# EAGLE design stm32f4_fc_simplified (EAGLE 8.2.2)
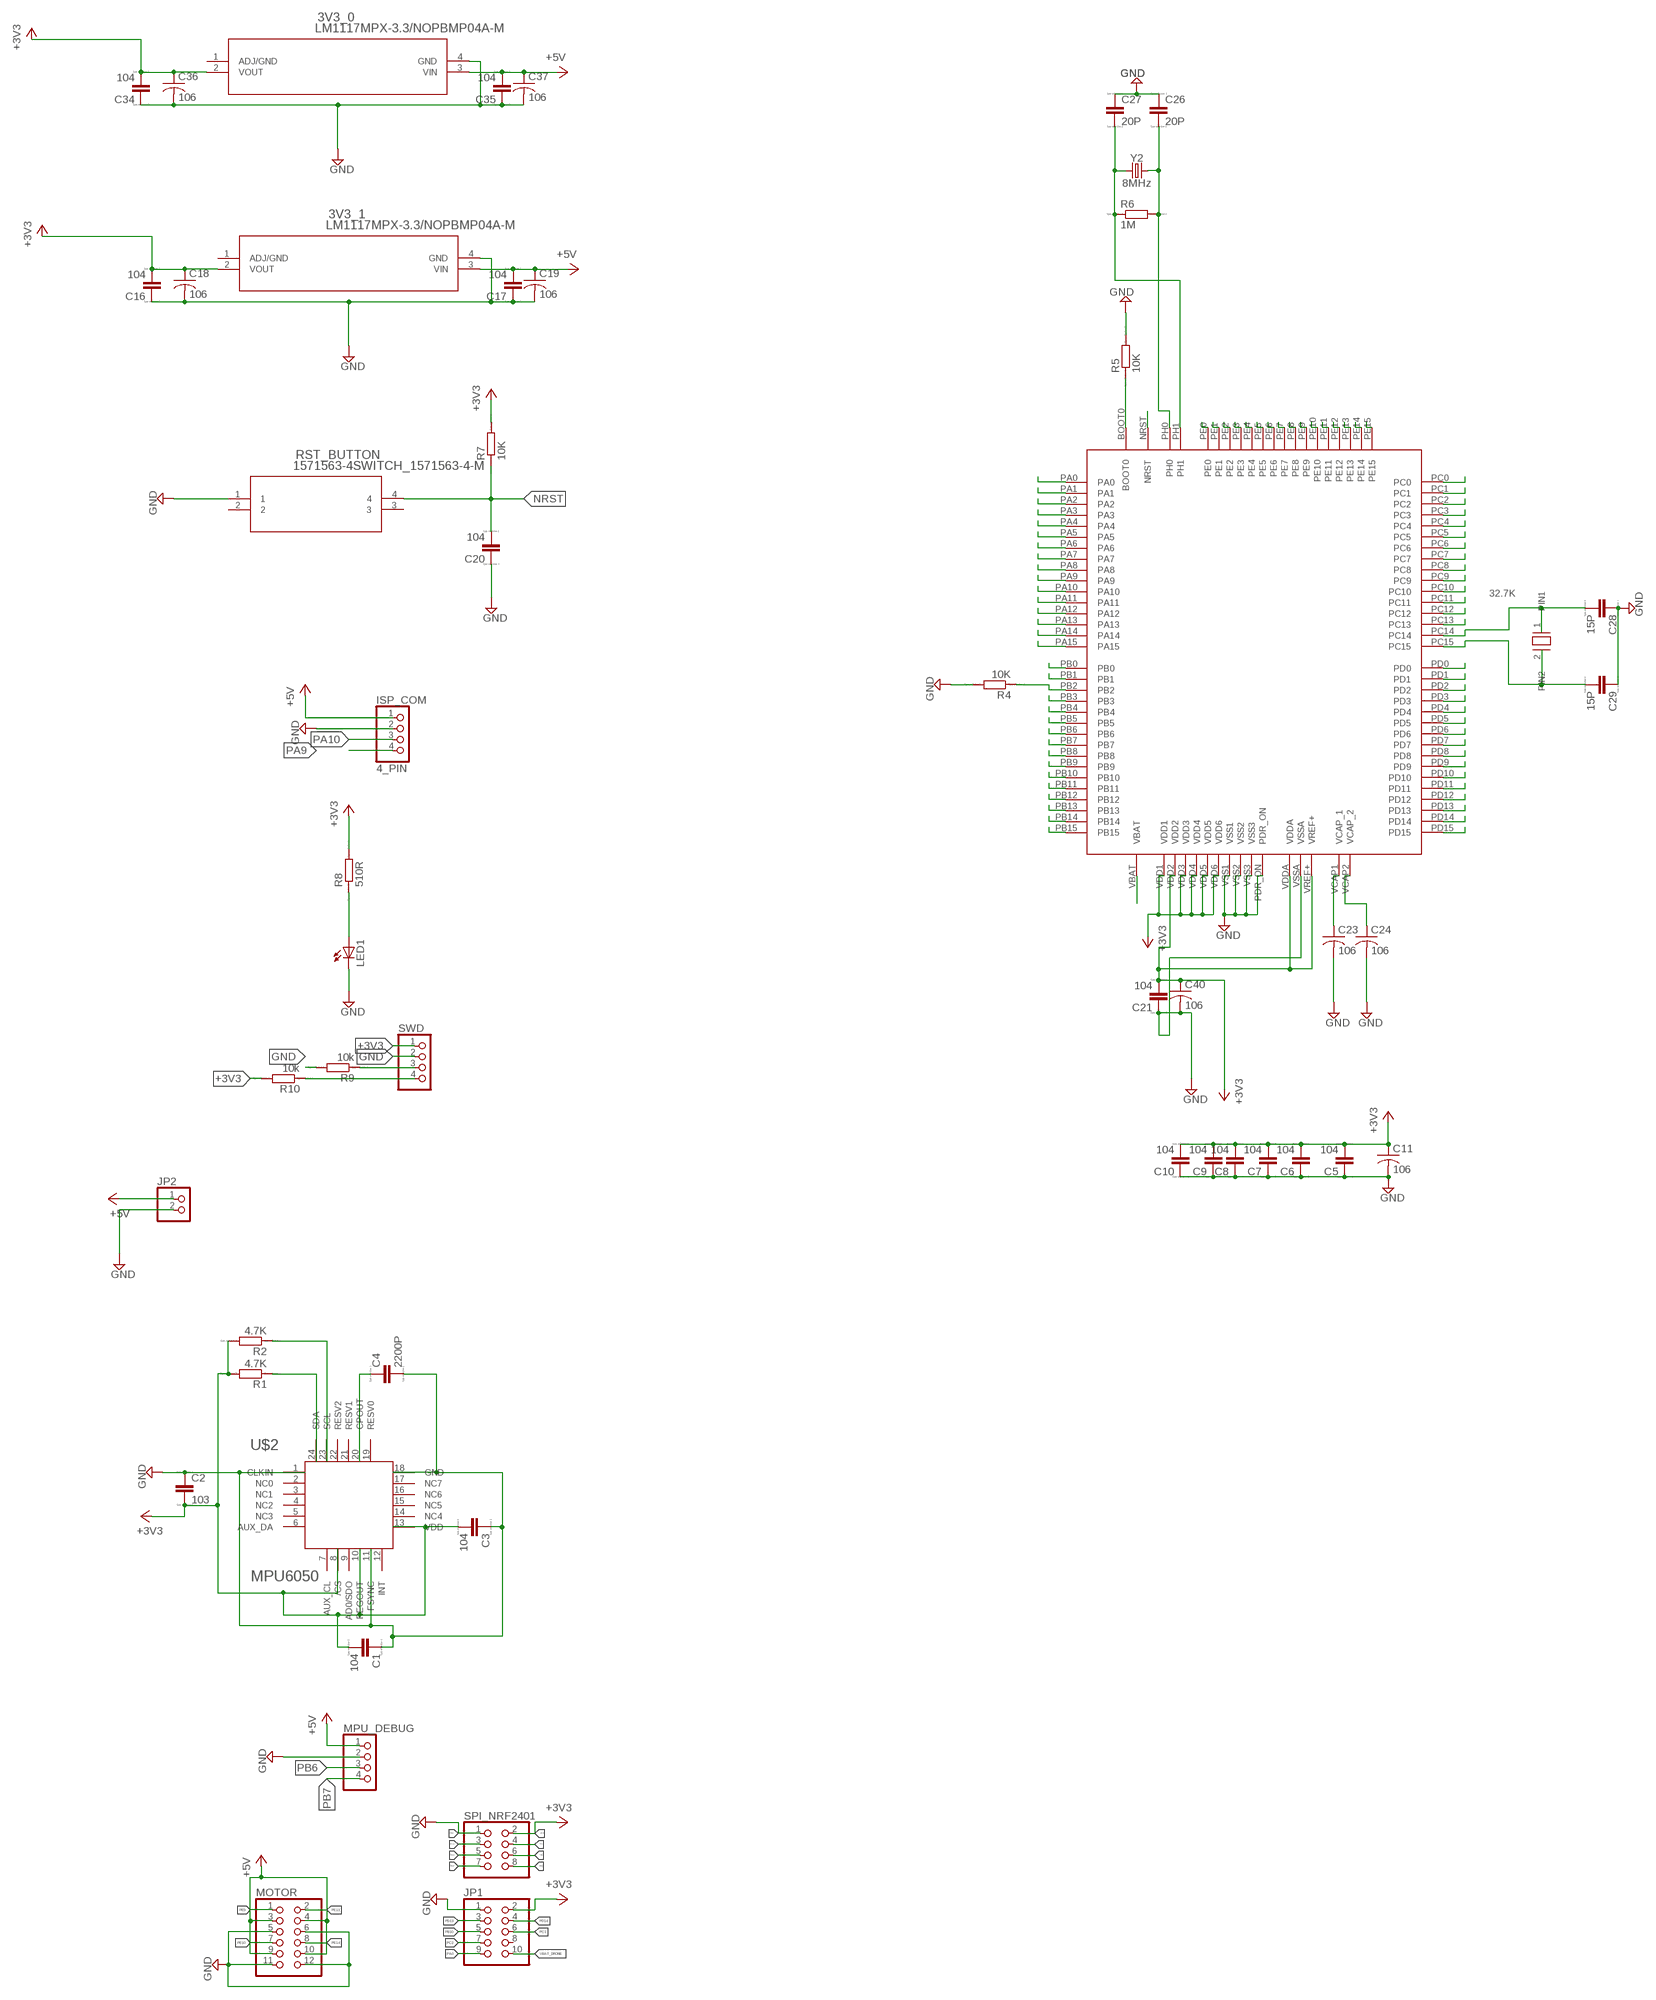
[diagram p0: schematic, sheet 1]

## Parts
3V3_0  LM1117MPX-3.3/NOPBMP04A-M  [MP04A-M]
3V3_1  LM1117MPX-3.3/NOPBMP04A-M  [MP04A-M]
32.7K  CM315D  [CM315D_32.7K]
C1  104  CC0603  [C0603]
C2  103  CC0603  [C0603]
C3  104  CC0603  [C0603]
C4  2200P  CC0603  [C0603]
C5  104  CC0603  [C0603]
C6  104  CC0603  [C0603]
C7  104  CC0603  [C0603]
C8  104  CC0603  [C0603]
C9  104  CC0603  [C0603]
C10  104  CC0603  [C0603]
C11  106  C-USC0805  [C0805]
C16  104  CC0603  [C0603]
C17  104  CC0603  [C0603]
C18  106  C-USC0805  [C0805]
C19  106  C-USC0805  [C0805]
C20  104  CC0603  [C0603]
C21  104  CC0603  [C0603]
C23  106  C-USC0805  [C0805]
C24  106  C-USC0805  [C0805]
C26  20P  CC0603  [C0603]
C27  20P  CC0603  [C0603]
C28  15P  CC0603  [C0603]
C29  15P  CC0603  [C0603]
C34  104  CC0603  [C0603]
C35  104  CC0603  [C0603]
C36  106  C-USC0805  [C0805]
C37  106  C-USC0805  [C0805]
C40  106  C-USC0805  [C0805]
ISP_COM  4_PIN  PINHD-1X4  [1X04]
JP1  PINHD-2X5/90  [2X05/90]
JP2  PINHD-1X2  [1X02]
LED1  LEDCHIPLED_0805  [CHIPLED_0805]
MOTOR  PINHD-2X6/90  [2X06/90]
MPU_DEBUG  PINHD-1X4  [1X04]
R1  4.7K  RR0603  [R0603]
R2  4.7K  RR0603  [R0603]
R4  10K  RR0603  [R0603]
R5  10K  RR0603  [R0603]
R6  1M  RR0603  [R0603]
R7  10K  RR0603  [R0603]
R8  510R  RR0603  [R0603]
R9  10k  RR0603  [R0603]
R10  10k  RR0603  [R0603]
RST_BUTTON  1571563-4SWITCH_1571563-4-M  [SWITCH_1571563-4-M]
SPI_NRF2401  PINHD-2X4  [2X04]
SWD  PINHD-1X4  [1X04]
U$1  STM32F4V_100PIN_GENERIC  [LQFP100]
U$2  MPU6050  [MPU6050]
Y2  8MHz  CRYSTAL-8MHZSMD-HC49UP  [HC49UP]

## Nets
+3V3: 3V3_0.2(VOUT) 3V3_1.2(VOUT) C1.2 C2.2 C3.2 C5.2 C6.2 C7.2 C8.2 C9.2 C10.2 C11.1 C16.2 C18.1 C21.2 C34.2 C36.1 C40.1 JP1.2 R1.2 R2.2 R7.2 R8.2 R10.2 SPI_NRF2401.2 SWD.1 U$1.VDD1 U$1.VDD2 U$1.VDD3 U$1.VDD4 U$1.VDD5 U$1.VDD6 U$1.VDDA U$1.VREF+ U$2.8(/CS) U$2.10(REGOUT) U$2.13(VDD)
+5V: 3V3_0.3(VIN) 3V3_1.3(VIN) C17.2 C19.1 C35.2 C37.1 ISP_COM.1 JP2.1 MOTOR.3 MOTOR.4 MOTOR.9 MOTOR.10 MPU_DEBUG.1
BOOT0: R5.1 U$1.BOOT0
GND: 3V3_0.4(GND) 3V3_1.4(GND) C1.1 C2.1 C3.1 C4.2 C5.1 C6.1 C7.1 C8.1 C9.1 C10.1 C11.2 C16.1 C17.1 C18.2 C19.2 C20.1 C21.1 C23.2 C24.2 C26.1 C27.1 C28.1 C29.1 C34.1 C35.1 C36.2 C37.2 C40.2 ISP_COM.2 JP1.1 JP2.2 LED1.C MOTOR.5 MOTOR.6 MOTOR.11 MOTOR.12 MPU_DEBUG.2 R4.2 R5.2 R9.2 RST_BUTTON.1 SPI_NRF2401.1 SWD.2 U$1.PDR_ON U$1.VSS1 U$1.VSS2 U$1.VSS3 U$1.VSSA U$2.1(CLKIN) U$2.11(FSYNC) U$2.18(GND)
IRQ: SPI_NRF2401.8
N$1: LED1.A R8.1
N$3: C4.1 U$2.20(CPOUT)
NRST: C20.2 R7.1 RST_BUTTON.4 U$1.NRST
PA0: JP1.9 U$1.PA0
PA1: U$1.PA1
PA2: U$1.PA2
PA3: U$1.PA3
PA4: U$1.PA4
PA5: SPI_NRF2401.5 U$1.PA5
PA6: SPI_NRF2401.7 U$1.PA6
PA7: SPI_NRF2401.6 U$1.PA7
PA8: U$1.PA8
PA9: ISP_COM.4 U$1.PA9
PA10: ISP_COM.3 U$1.PA10
PA11: U$1.PA11
PA12: U$1.PA12
PA13: R10.1 SWD.4 U$1.PA13
PA14: R9.1 SWD.3 U$1.PA14
PA15: U$1.PA15
PB0: U$1.PB0
PB1: U$1.PB1
PB2: R4.1 U$1.PB2
PB3: U$1.PB3
PB4: U$1.PB4
PB5: U$1.PB5
PB6: MPU_DEBUG.3 R2.1 U$1.PB6 U$2.23(SCL)
PB7: MPU_DEBUG.4 R1.1 U$1.PB7 U$2.24(SDA)
PB8: U$1.PB8
PB9: U$1.PB9
PB10: JP1.5 U$1.PB10
PB11: U$1.PB11
PB12: U$1.PB12
PB13: U$1.PB13
PB14: U$1.PB14
PB15: U$1.PB15
PC0: U$1.PC0
PC1: U$1.PC1
PC2: JP1.7 U$1.PC2
PC3: JP1.6 U$1.PC3
PC4: SPI_NRF2401.3 U$1.PC4
PC5: SPI_NRF2401.4 U$1.PC5
PC6: U$1.PC6
PC7: U$1.PC7
PC8: U$1.PC8
PC9: U$1.PC9
PC10: U$1.PC10
PC11: U$1.PC11
PC12: U$1.PC12
PC13: U$1.PC13
PC14: 32.7K.1(PIN1) C28.2 U$1.PC14
PC15: 32.7K.2(PIN2) C29.2 U$1.PC15
PD0: U$1.PD0
PD1: U$1.PD1
PD2: U$1.PD2
PD3: U$1.PD3
PD4: U$1.PD4
PD5: U$1.PD5
PD6: U$1.PD6
PD7: U$1.PD7
PD8: U$1.PD8
PD9: U$1.PD9
PD10: U$1.PD10
PD11: U$1.PD11
PD12: U$1.PD12
PD13: JP1.3 U$1.PD13
PD14: JP1.4 U$1.PD14
PD15: U$1.PD15
PE0: U$1.PE0
PE1: U$1.PE1
PE2: U$1.PE2
PE3: U$1.PE3
PE4: U$1.PE4
PE5: U$1.PE5
PE6: U$1.PE6
PE7: U$1.PE7
PE8: U$1.PE8
PE9: MOTOR.1 U$1.PE9
PE10: MOTOR.7 U$1.PE10
PE11: U$1.PE11
PE12: U$1.PE12
PE13: MOTOR.2 U$1.PE13
PE14: MOTOR.8 U$1.PE14
PE15: U$1.PE15
PH0: C26.2 R6.2 U$1.PH0 Y2.2
PH1: C27.2 R6.1 U$1.PH1 Y2.1
VBAT: U$1.VBAT
VBAT_DRONE: JP1.10
VCAP1: C23.1 U$1.VCAP1(VCAP_1)
VCAP2: C24.1 U$1.VCAP2(VCAP_2)
Unconnected: 3V3_0.1(ADJ/GND) 3V3_1.1(ADJ/GND) JP1.8 RST_BUTTON.2 RST_BUTTON.3 U$2.2(NC0) U$2.3(NC1) U$2.4(NC2) U$2.5(NC3) U$2.6(AUX_DA) U$2.7(AUX_CL) U$2.9(AD0/SDO) U$2.12(INT) U$2.14(NC4) U$2.15(NC5) U$2.16(NC6) U$2.17(NC7) U$2.19(RESV0) U$2.21(RESV1) U$2.22(RESV2)

## Library data of the parts
3V3_0 3V3_1 = lm1117:LM1117MPX-3.3/NOPB; MANUFACTURER_PART_NUMBER: LM1117MPX3.3NOPB; VENDOR: National Semiconductor
32.7K = CM315D_PAC:CM315D
C1-C10 C16 C17 C20 C21 C26-C29 C34 C35 = eagle-ltspice:C: CAPACITOR, European symbol; SPICEMODEL: NONE; SPICEPREFIX: C
C11 C18 C19 C23 C24 C36 C37 C40 = rcl:C-US: CAPACITOR, American symbol
ISP_COM MPU_DEBUG SWD = pinhead:PINHD-1X4: PIN HEADER
JP1 = pinhead:PINHD-2X5: PIN HEADER
JP2 = pinhead:PINHD-1X2: PIN HEADER
LED1 = led:LED: LED OSRAM: - CHIPLED LG R971, LG N971, LY N971, LG Q971, LY Q971, LO R971, LY R971 LH N974, LH R974 LS Q976, LO Q976, LY Q976 LO Q996 - Hyper CHIPLED LW Q18S LB Q993, LB Q99A, LB R99A - SideLED LS A670, LO A670, LY A670, LG A670, LP A670 LB A673, LV A673, LT A673, LW A673 LH A674 LY A675 LS A676, LA A676, LO A676, LY A676, LW A676 LS A679, LY A679, LG A679 - Hyper Micro SIDELED® LS Y876, LA Y876, LO Y876, LY Y876 LT Y87S - SmartLED LW L88C, LW L88S LB L89C, LB L89S, LG L890 LS L89K, LO L89K, LY L89K LS L896, LA L896, LO L896, LY L896 - TOPLED LS T670, LO T670, LY T670, LG T670, LP T670 LSG T670, LSP T670, LSY T670, LOP T670, LYG T670 LG T671, LOG T671, LSG T671 LB T673, LV T673, LT T673, LW T673 LH T674 LS T676, LA T676, LO T676, LY T676, LB T676, LH T676, LSB T676, LW T676 LB T67C, LV T67C, LT T67C, LS T67K, LO T67K, LY T67K, LW E67C LS E67B, LA E67B, LO E67B, LY E67B, LB E67C, LV E67C, LT E67C LW T67C LS T679, LY T679, LG T679 LS T770, LO T770, LY T770, LG T770, LP T770 LB T773, LV T773, LT T773, LW T773 LH T774 LS E675, LA E675, LY E675, LS T675 LS T776, LA T776, LO T776, LY T776, LB T776 LHGB T686 LT T68C, LB T68C - Hyper Mini TOPLED® LB M676 - Mini TOPLED Santana® LG M470 LS M47K, LO M47K, LY M47K Source: http://www.osram.convergy.de LUXEON: - LUMILED® LXK2-PW12-R00, LXK2-PW12-S00, LXK2-PW14-U00, LXK2-PW14-V00 LXK2-PM12-R00, LXK2-PM12-S00, LXK2-PM14-U00 LXK2-PE12-Q00, LXK2-PE12-R00, LXK2-PE12-S00, LXK2-PE14-T00, LXK2-PE14-U00 LXK2-PB12-K00, LXK2-PB12-L00, LXK2-PB12-M00, LXK2-PB14-N00, LXK2-PB14-P00, LXK2-PB14-Q00 LXK2-PR12-L00, LXK2-PR12-M00, LXK2-PR14-Q00, LXK2-PR14-R00 LXK2-PD12-Q00, LXK2-PD12-R00, LXK2-PD12-S00 LXK2-PH12-R00, LXK2-PH12-S00 LXK2-PL12-P00, LXK2-PL12-Q00, LXK2-PL12-R00 Source: www.luxeon.com KINGBRIGHT: KA-3528ASYC Source: www.kingbright.com
MOTOR = pinhead:PINHD-2X6: PIN HEADER
R1 R2 R4-R10 = eagle-ltspice:R: RESISTOR, European symbol; SPICEMODEL: NONE; SPICEPREFIX: R
RST_BUTTON = pushbutton_sw_surface_mt:1571563-4; MANUFACTURER_PART_NUMBER: 15715634; VENDOR: Tyco Electronics
SPI_NRF2401 = pinhead:PINHD-2X4: PIN HEADER
U$1 = stm32f4:STM32F4V_100PIN_GENERIC
U$2 = mpu6050_pac:MPU6050
Y2 = SparkFun-Clocks:CRYSTAL-8MHZ: 8MHz Crystal Datasheet Example <http://www.futureelectronics.com/en/technologies/electromechanical/timing-devices/crystals/Pages/6008189-ABM3B-8.000MHZ-B2-T.aspx?IM=0> Frequency: 8MHz Frequency Tolerance: ±20ppm Load Capacitance: 18pF SparkFun Products: Pro Micro -3.3V/8MHz <https://www.sparkfun.com/products/12587> WAV Trigger <https://www.sparkfun.com/products/13660>; PROD_ID: XTAL-11706

## Board
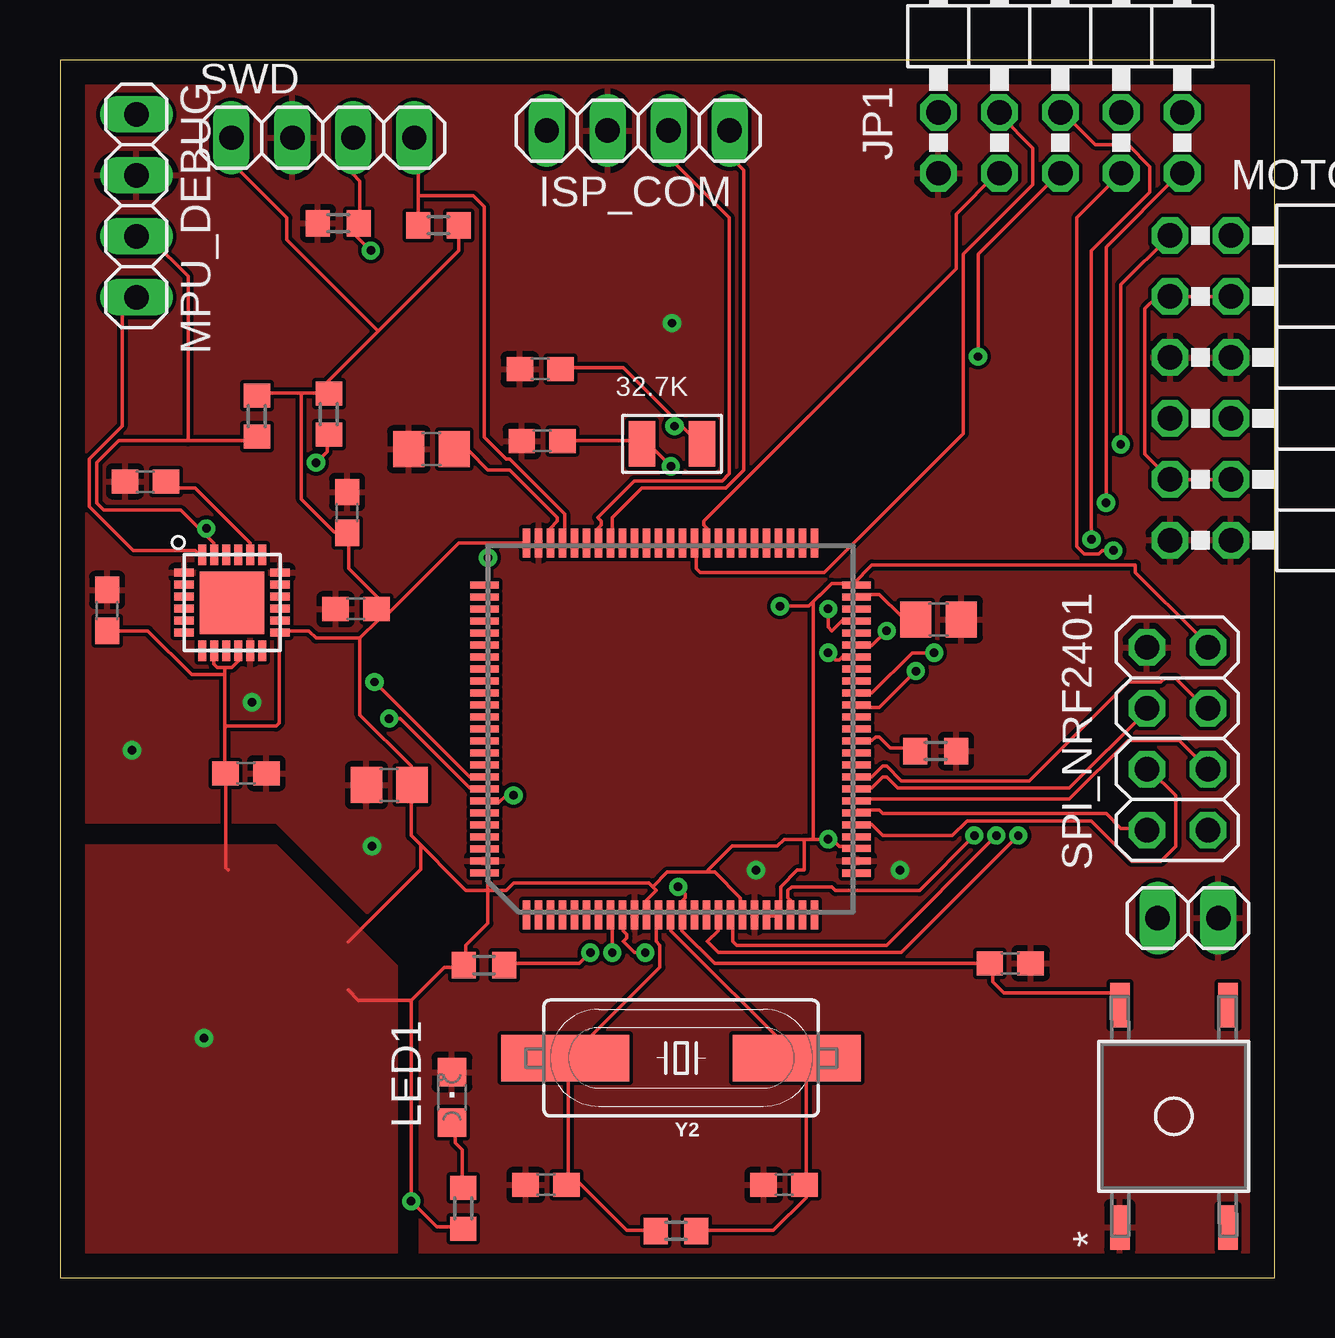
[diagram p1: board, top side]
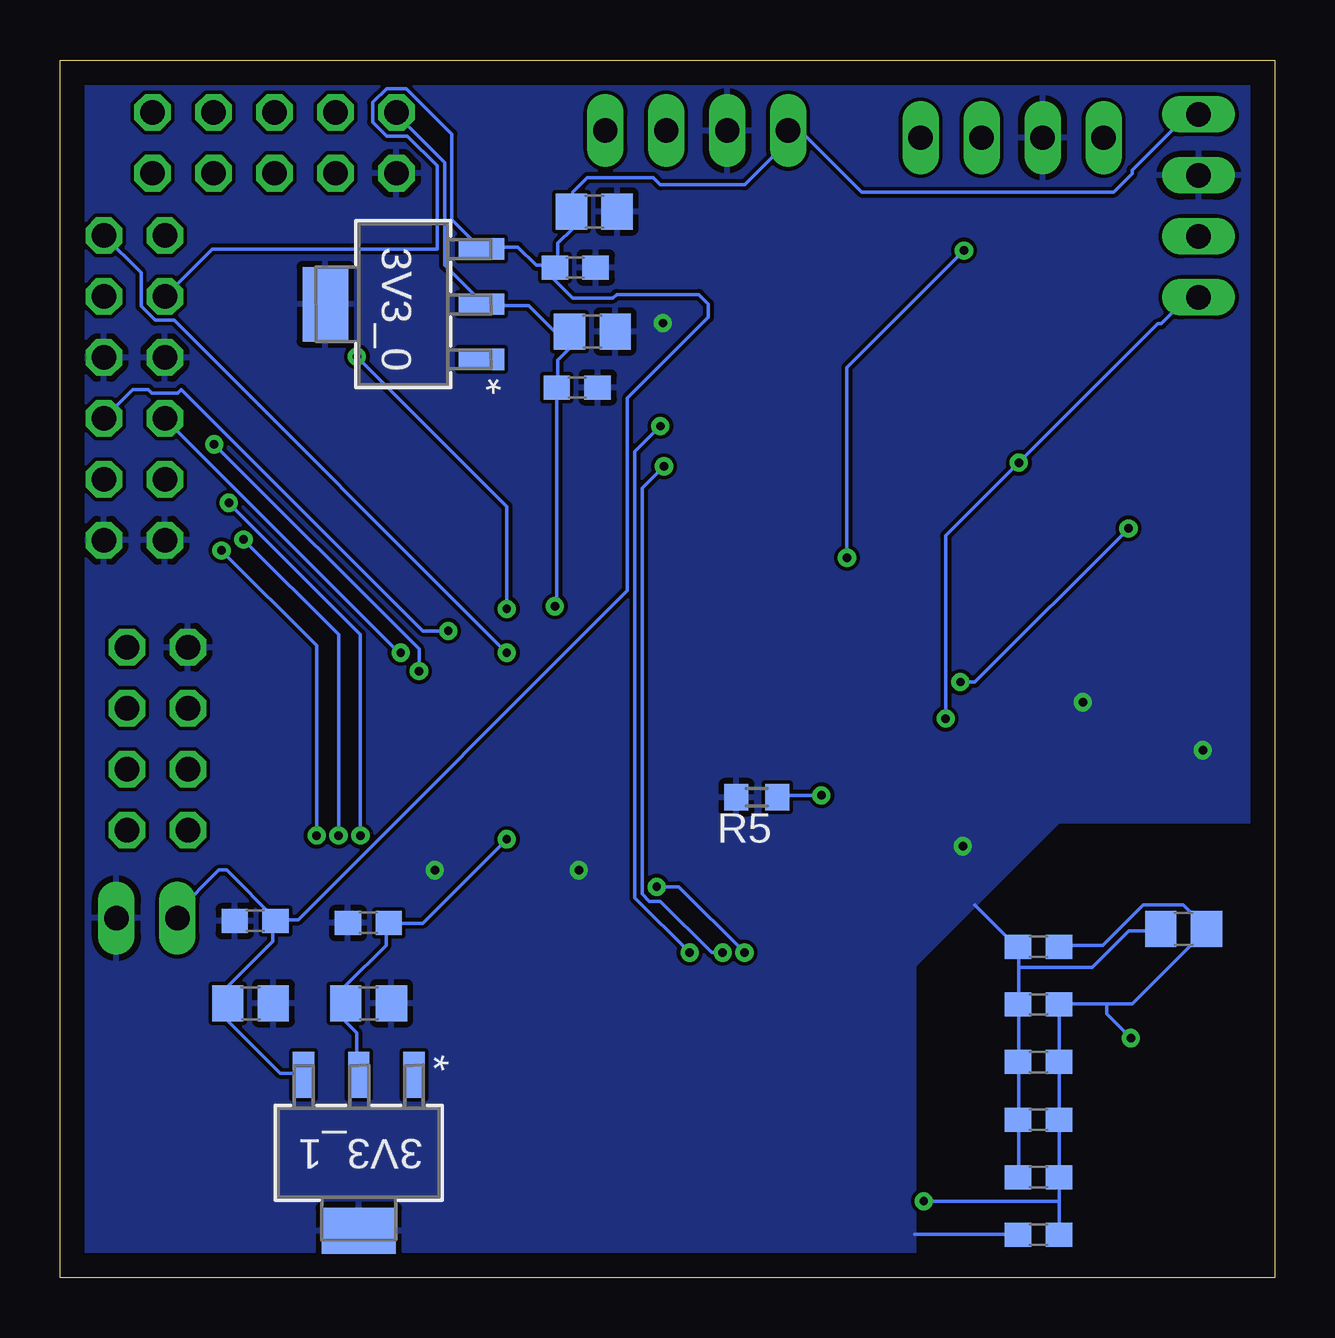
[diagram p2: board, bottom side, seen from below]

Size 50.62 x 50.77 mm. Coordinates in mm from the lower left corner, seen from the top.
Outline: 0,0 50.62,0 50.62,50.77 0,50.77 0,0
Copper layers (1*16): Top 0.035mm / dielectric 1.5mm / Bottom 0.035mm
Design rules "default": minimum track width 6mil, minimum drill 0.35mm, track to track 6mil, track to pad 6mil, pad to pad 6mil, via to via 6mil, smd to smd 6mil, copper to edge 40mil, drill to drill 6mil, minimum pad ring 10mil, minimum via ring 8mil, stop-mask expansion 4mil, vias tented up to drill 0mil, thermal gap 10mil

### Footprints (pad centres in the part's own frame; a part is rotated, then mirrored left to right if it is on the bottom)
MP04A-M = smd 1.905 x 0.889: 1 -3.251,2.3; 2 -3.251,0; 3 -3.251,-2.3 | smd 1.905 x 3.099: 4 3.251,0
CM315D_32.7K = smd 1.1 x 1.9: 1 0,0; 2 2.5,0
C0603 = smd 1.1 x 1: 1 -0.85,0; 2 0.85,0
C0805 = smd 1.3 x 1.5: 1 -0.95,0; 2 0.95,0
1X04 = drill 1.016 long: 1 -3.81,0; 2 -1.27,0; 3 1.27,0; 4 3.81,0
2X05/90 = drill 1.016 octagon: 1 -5.08,-6.35; 2 -5.08,-3.81; 3 -2.54,-6.35; 4 -2.54,-3.81; 5 0,-6.35; 6 0,-3.81; 7 2.54,-6.35; 8 2.54,-3.81; 9 5.08,-6.35; 10 5.08,-3.81
1X02 = drill 1.016 long: 1 -1.27,0; 2 1.27,0
CHIPLED_0805 = smd 1.2 x 1.2: A 0,-1.05; C 0,1.05
2X06/90 = drill 1.016 octagon: 1 -6.35,-6.35; 2 -6.35,-3.81; 3 -3.81,-6.35; 4 -3.81,-3.81; 5 -1.27,-6.35; 6 -1.27,-3.81; 7 1.27,-6.35; 8 1.27,-3.81; 9 3.81,-6.35; 10 3.81,-3.81; 11 6.35,-6.35; 12 6.35,-3.81
R0603 = smd 1 x 1.1: 1 -0.85,0; 2 0.85,0
SWITCH_1571563-4-M = smd 1.854 x 0.813: 1 -4.636,2.248; 2 -4.636,-2.248; 3 4.636,-2.248; 4 4.636,2.248
2X04 = drill 1.016 octagon: 1 -3.81,-1.27; 2 -3.81,1.27; 3 -1.27,-1.27; 4 -1.27,1.27; 5 1.27,-1.27; 6 1.27,1.27; 7 3.81,-1.27; 8 3.81,1.27
LQFP100 = smd 1.2 x 0.3: BOOT0 -7.75,-3; PA3 7.75,-6.016; PA4 7.75,-4.5; PA5 7.75,-4; PA6 7.75,-3.5; PA7 7.75,-3; PA14 -7.75,6; PA15 -7.75,5.5; PB0 7.75,-1.5; PB1 7.75,-1; PB2 7.75,-0.5; PB3 -7.75,-0.5; PB4 -7.75,-1; PB5 -7.75,-1.5; PB6 -7.75,-2; PB7 -7.75,-2.5; PB8 -7.75,-3.5; PB9 -7.75,-4; PB10 7.75,4.5; PB11 7.75,5; PC4 7.75,-2.5; PC5 7.75,-2; PC10 -7.75,5; PC11 -7.75,4.5; PC12 -7.75,4; PD0 -7.75,3.5; PD1 -7.75,3; PD2 -7.75,2.5; PD3 -7.75,2; PD4 -7.75,1.5; PD5 -7.75,1; PD6 -7.75,0.5; PD7 -7.75,0; PDR_ON -7.75,-5.5; PE0 -7.75,-4.5; PE1 -7.75,-5; PE7 7.75,0; PE8 7.75,0.5; PE9 7.75,1; PE10 7.75,1.5; PE11 7.75,2; PE12 7.75,2.5; PE13 7.75,3; PE14 7.75,3.5; PE15 7.75,4; VCAP1 7.75,5.5; VDD3 7.75,-4.984; VDD4 7.75,6; VDD6 -7.75,-6; VSS2 7.75,-5.5 | smd 0.3 x 1.2: NRST 0.5,-7.75; PA0 5,-7.75; PA1 5.5,-7.75; PA2 6,-7.75; PA8 -2,7.75; PA9 -2.5,7.75; PA10 -3,7.75; PA11 -3.5,7.75; PA12 -4,7.75; PA13 -4.5,7.75; PB12 6,7.75; PB13 5.5,7.75; PB14 5,7.75; PB15 4.5,7.75; PC0 1,-7.75; PC1 1.5,-7.75; PC2 2,-7.75; PC3 2.5,-7.75; PC6 0,7.75; PC7 -0.5,7.75; PC8 -1,7.75; PC9 -1.5,7.75; PC13 -3,-7.75; PC14 -2.5,-7.75; PC15 -2,-7.75; PD8 4,7.75; PD9 3.5,7.75; PD10 3,7.75; PD11 2.5,7.75; PD12 2,7.75; PD13 1.5,7.75; PD14 1,7.75; PD15 0.5,7.75; PE2 -6,-7.75; PE3 -5.5,-7.75; PE4 -5,-7.75; PE5 -4.5,-7.75; PE6 -4,-7.75; PH0 -0.5,-7.75; PH1 0,-7.75; VBAT -3.5,-7.75; VCAP2 -5,7.75; VDD1 -1,-7.75; VDD2 3,-7.75; VDD5 -6,7.75; VDDA 4.5,-7.75; VREF+ 4,-7.75; VSS1 -1.5,-7.75; VSS3 -5.5,7.75; VSSA 3.5,-7.75
MPU6050 = smd 0.8 x 0.34: 1 0,0; 2 0,-0.5; 3 0,-1; 4 0,-1.5; 5 0,-2; 6 0,-2.5; 13 4,-2.5; 14 4,-2; 15 4,-1.5; 16 4,-1; 17 4,-0.5; 18 4,0 | smd 0.34 x 0.85: 7 0.75,-3.25; 8 1.25,-3.25; 9 1.75,-3.25; 10 2.25,-3.25; 11 2.75,-3.25; 12 3.25,-3.25; 19 3.25,0.75; 20 2.75,0.75; 21 2.25,0.75; 22 1.75,0.75; 23 1.25,0.75; 24 0.75,0.75 | smd 2.7 x 2.6: P$26 2,-1.25
HC49UP = smd 5.334 x 1.93: 1 -4.826,0; 2 4.826,0

### Placement (x,y rotation side)
3V3_0  36.31,40.59 180 bottom
3V3_1  38.17,5.22 270 bottom
32.7K  24.25,34.77 0 top
C1  7.75,21.04 180 top
C2  1.96,27.83 270 top
C3  11.96,31.91 270 top
C4  3.56,33.2 180 top
C5  9.85,1.8 0 bottom
C6  9.85,4.2 0 bottom
C7  9.85,6.6 0 bottom
C8  9.85,9 0 bottom
C9  9.85,11.4 0 bottom
C10  9.85,13.8 0 bottom
C11  3.8,14.55 180 bottom
C16  37.77,14.8 0 bottom
C17  42.49,14.88 0 bottom
C18  37.76,11.45 0 bottom
C19  42.68,11.45 0 bottom
C20  39.59,13.12 180 top
C21  12.33,27.88 0 top
C23  36.6,27.45 0 top
C24  15.48,34.55 180 top
C26  20.25,3.88 0 top
C27  30.17,3.88 0 top
C28  20.09,34.88 0 top
C29  20.01,37.88 0 top
C34  29.07,37.12 180 bottom
C35  29.15,42.12 180 bottom
C36  28.44,39.45 0 bottom
C37  28.36,44.45 0 bottom
C40  13.72,20.55 180 top
ISP_COM  24.09,47.83 0 top
JP1  41.68,52.4 0 top
JP2  47,15 0 top
LED1  16.33,7.53 0 top
MOTOR  52.6,37.1 270 top
MPU_DEBUG  3.18,44.69 270 top
R1  11.2,36.01 90 top
R2  8.2,35.93 90 top
R4  36.49,21.96 0 top
R5  21.59,20.04 180 bottom
R6  25.67,1.96 180 top
R7  17.67,13.04 180 top
R8  16.8,2.91 270 top
R9  11.59,43.96 180 top
R10  15.77,43.88 0 top
RST_BUTTON  46.41,6.74 90 top
SPI_NRF2401  46.56,22.48 270 top
SWD  10.95,47.53 0 top
U$1  25.44,22.89 0 top
U$2  5.17,29.4 0 top
Y2  25.88,9.17 180 top

### Tracks (layer width: path | path; a pad name or v marks a point on that pad's centre or on a via)
+3V3  (via drill 0.35)
  Top 0.152: SPI_NRF2401.2 47.7,26.36 47.4,26.67 47.4,26.82 44.81,29.41 44.81,29.72 33.83,29.72 33.07,28.96 | 11.12,36.88 10.06,36.88 | 10.06,36.88 8.23,36.88 R2.2 | 13.26,39.47 11.12,37.34 11.12,36.88 | 13.26,39.47 16.61,42.82 16.61,43.74 R10.2 | 11.12,36.88 R1.2 | 13.26,39.47 9.45,43.28 9.45,44.2 7.16,46.48 7.16,47.4 SWD.1 | 6.86,25.45 7.16,25.45 7.47,25.76 7.47,26.06 U$2.10 | 6.86,25.45 6.55,25.45 6.4,25.6 6.4,26.06 U$2.8 | 6.86,25.45 6.86,25.15 | 6.86,22.9 6.86,25.15 | 6.86,22.9 6.86,21.18 C1.2 6.9,17.1 7,17 | 6.86,25.15 5.49,25.15 3.66,26.98 1.98,26.98 C2.2 | 12.5,26.67 10.67,26.67 10.36,26.98 9.3,26.98 U$2.13 9.14,26.82 9.14,23.14 9,23 6.96,23 6.86,22.9 | 12.5,26.67 13.26,27.43 13.26,27.74 | 13.26,27.74 13.72,27.74 16.61,30.63 19.36,30.63 U$1.VDD5 | 13.26,27.74 C21.2 13.26,27.89 13.26,28.35 12.04,29.57 12.04,30.94 C3.2 11.89,31.09 11.43,31.09 10.06,32.46 10.06,36.88 | U$1.VREF+ 29.57,15.09 29.87,15.09 U$1.VDDA 30.02,15.24 30.02,16.31 30.72,17 31,17 31,18.29 | 14.63,11.58 v14.63,3.2 15.7,2.13 16.76,2.13 R8.2 | 14.63,11.58 16,12.95 16.76,12.95 R7.2 16.92,13.11 16.92,13.87 17.83,14.78 17.83,16.15 | 17.83,16.15 17.83,16.76 U$1.VDD6 | 24.69,16.31 24.54,16.46 18.9,16.46 18.59,16.15 17.83,16.15 | 24.69,16.31 24.84,16.15 24.38,15.7 24.38,15.24 U$1.VDD1 | 27,16.92 25.3,16.92 24.69,16.31 | 27,16.92 27.28,16.92 28.35,15.85 28.35,15.24 U$1.VDD2 | 31,18.29 30.18,18.29 29.89,18 28,18 27,17 27,16.92 | 31,18.29 31.39,18.29 | 31.39,18.29 v32,18.29 32.16,18.29 32.46,17.98 33.07,17.98 U$1.VDD3 | 33.07,28.96 32.16,28.96 32,28.8 | 32,28.8 31.39,28.19 31.39,18.29 | 17.83,16.15 16.92,16.15 14.63,18.44 14.63,20.42 C40.1 14.63,20.57 14.63,21.34 12.5,23.47 12.5,26.67
  Top 0.152: 33.07,28.96 U$1.VDD4 | 14.63,11.58 12.42,11.58 12,12 | 15.04,18.04 15.04,17.04 12,14 | v30,28 31.2,28 32,28.8
  Bottom 0.152: JP1.2 36.58,48.46 34.59,46.48 34.59,42.22 33.07,40.69 3V3_0.2 32.92,40.54 31.09,40.54 30.02,39.47 29.41,39.47 C36.1 29.41,39.32 29.41,38.71 29.87,38.25 29.87,37.19 C34.2 29.92,28.08 v30,28 | C10.2 8.99,13.87 7.16,13.87 5.49,15.54 3.81,15.54 2.9,14.63 C11.1 2.9,14.48 5.94,11.43 8.99,11.43 C9.2 8.99,11.28 8.99,9.14 C8.2 8.99,6.71 C7.2 8.99,6.55 8.99,4.27 C6.2 8.99,4.12 8.99,3.2 | 8.99,3.2 8.99,1.83 C5.2 | 3V3_1.2 38.25,8.53 38.25,10.21 38.71,10.67 38.71,11.43 C18.1 38.71,11.58 38.71,12.19 37.03,13.87 37.03,14.78 C16.2 36.88,14.78 35.51,14.78 v32,18.29 | v14.63,3.2 8.99,3.2 | 7,11.43 7,11 v6,10
  pour Top: 1,18 9,18 14,13 14,0 1,0
+5V
  Top 0.152: MOTOR.10 MOTOR.9 45.2,34.34 45.2,40.4 45.71,40.91 MOTOR.3 MOTOR.4
  Bottom 0.152: 3V3_1.3 40.54,8.53 41.45,8.53 43.59,10.67 43.59,11.43 C19.1 43.59,11.58 43.59,12.19 41.76,14.02 41.76,14.78 C17.2 41.6,14.94 | C35.2 29.87,42.22 29.87,43.13 29.26,43.74 29.26,44.35 C37.1 29.26,44.5 29.26,45.26 28.65,45.87 25.91,45.87 25.6,45.57 22.1,45.57 20.42,47.24 20.42,47.7 ISP_COM.1 20.27,47.7 19.66,47.7 17.22,45.26 6.71,45.26 5.94,46.02 5.94,46.18 3.66,48.46 3.2,48.46 MPU_DEBUG.1 | C35.2 30.02,42.22 30.79,42.22 31.55,42.98 32.92,42.98 3V3_0.3 34.29,44.12 34.29,47.68 36.19,49.58 37.01,49.58 37.59,49 37.59,48.18 37.01,47.6 36.14,47.6 34.9,46.36 34.9,42.89 44.27,42.89 MOTOR.3 | 41.6,14.94 40.69,14.94 26.98,28.65 26.98,36.67 23.6,40.04 23.6,40.6 24,41 27.43,41 27.58,40.84 29.26,40.84 30.02,41.6 30.02,42.06 C35.2 | JP2.1 45.73,15.27 44,17 43.67,17 41.6,14.94
BOOT0  (via drill 0.35)
  Top 0.152: v18.9,20.12 18.59,20.12 18.29,19.81 17.83,19.81 U$1.BOOT0
  Bottom 0.152: v18.9,20.12 20.73,20.12 R5.1
GND  (via drill 0.35)
  Bottom 0.152: 15,1.83 10.82,1.83 C5.1 | C6.1 10.67,4.27 10.67,6.55 C7.1 10.67,6.71 10.67,8.99 C8.1 10.67,9.14 10.67,11.28 C9.1 10.67,11.43 10.67,12.95 | 10.67,12.95 10.67,13.72 C10.1 10.82,13.87 12.5,15.54 | 10.67,12.95 7.62,12.95 6.1,14.48 4.88,14.48 C11.2
  other vias: 35,17 29,17 8,24 3,22 13,18 25.5,39.8
  pour Top: 0,51 51,51 51,0 15,0 15,13 9,19 0,19
  pour Bottom: 0,51 51,51 51,0 15,0 15,13 9,19 0,19
N$1
  Top 0.152: R8.1 16.76,3.81 16.76,5.33 16.46,5.64 16.46,6.4 LED1.A
N$3
  Top 0.152: U$2.20 7.92,30.18 7.92,30.63 5.64,32.92 4.57,32.92 4.42,33.07 C4.1
NRST  (via drill 0.35)
  Top 0.152: RST_BUTTON.4 44.2,11.43 43.74,11.89 39.32,11.89 38.86,12.34 38.86,13.11 C20.2 38.71,13.11 27.28,13.11 25.91,14.48 25.91,15.09 U$1.NRST 25.91,15.24 25.91,15.7 26.06,15.85 26.06,16 v25.76,16.31 | v22.1,13.56 21.64,13.11 18.59,13.11 R7.1
  Bottom 0.152: v22.1,13.56 24.84,16.31 v25.76,16.31
PA0  (via drill 0.35)
  Top 0.152: v38.1,18.44 35.81,16.15 32.31,16.15 32.16,16.31 30.48,16.31 30.33,16.15 30.33,15.85 30.48,15.7 30.48,15.24 U$1.PA0 | v43.59,32.31 43.59,42.98 46.63,46.02 JP1.9
  Bottom 0.152: v38.1,18.44 38.1,26.82 v43.59,32.31
PA5
  Top 0.152: U$1.PA5 33.22,18.9 33.83,18.9 34.29,18.44 37.19,18.44 37.8,19.05 42.98,19.05 44.65,17.37 45.87,17.37 46.48,17.98 46.48,20.12 45.41,21.18 SPI_NRF2401.5
PA6
  Top 0.152: U$1.PA6 33.22,19.51 34.14,19.51 34.29,19.36 43.59,19.36 44.2,18.75 45.26,18.75 SPI_NRF2401.7
PA7
  Top 0.152: U$1.PA7 33.22,19.96 42.06,19.96 44.5,22.4 46.63,22.4 47.7,21.34 SPI_NRF2401.6
PA9
  Top 0.152: U$1.PA9 23.01,30.79 23.01,31.7 24.23,32.92 27.74,32.92 28.5,33.68 28.5,46.18 28.04,46.63 28.04,47.7 ISP_COM.4
PA10
  Top 0.152: U$1.PA10 22.4,30.79 22.4,31.24 22.55,31.39 22.55,31.55 22.4,31.7 23.93,33.22 27.58,33.22 27.89,33.53 27.89,44.2 25.45,46.63 25.45,47.7 ISP_COM.3
PA13
  Top 0.152: 14.94,45.11 14.94,47.24 14.78,47.4 SWD.4 | 14.94,45.11 14.94,43.89 R10.1 | 14.94,45.11 17.22,45.11 17.68,44.65 17.68,35.05 18.59,34.14 18.75,34.14 21.03,31.85 21.03,30.79 U$1.PA13
PA14  (via drill 0.35)
  Top 0.152: SWD.3 12.19,47.4 12.19,46.02 12.5,45.72 12.5,44.04 R9.1 12.34,43.89 12.34,43.43 v12.95,42.82 | v17.83,30.02 17.83,28.96 U$1.PA14
  Bottom 0.152: v17.83,30.02 17.83,37.95 v12.95,42.82
PB2
  Top 0.152: R4.1 35.51,22.1 34.59,22.1 34.14,22.55 33.98,22.55 33.83,22.4 33.22,22.4 U$1.PB2
PB6  (via drill 0.35)
  Top 0.152: 5.94,31.09 5.03,32 1.83,32 1.52,32.31 1.52,33.98 2.44,34.9 5.33,34.9 | 5.94,31.09 6.4,30.63 6.4,30.18 U$2.23 | 5.33,34.9 7.92,34.9 8.08,35.05 R2.1 | v13.11,24.84 17.07,20.88 17.68,20.88 U$1.PB6 | 5.94,31.09 v6.1,31.24 | 5.33,34.9 5.33,41.76 3.81,43.28 3.2,43.28 MPU_DEBUG.3
  Bottom 0.152: v13.11,24.84 12.5,24.84 v6.1,31.24
PB7  (via drill 0.35)
  Top 0.152: U$2.24 5.79,30.18 5.64,30.33 3.05,30.33 1.22,32.16 1.22,34.14 2.59,35.51 2.59,40.39 3.05,40.84 MPU_DEBUG.4 | v10.67,33.98 11.12,34.44 11.12,35.05 R1.1 | v13.72,23.32 14.17,23.32 17.07,20.42 17.68,20.42 U$1.PB7
  Bottom 0.152: MPU_DEBUG.4 3.2,40.84 3.66,40.84 4.72,39.78 4.88,39.78 v10.67,33.98 13.72,30.94 v13.72,23.32
PB10  (via drill 0.35)
  Top 0.152: v32,27.89 32,27.13 32.16,26.98 32.61,27.43 33.07,27.43 U$1.PB10 | v38.25,38.41 38.25,42.67 41.6,46.02 JP1.5
  Bottom 0.152: v32,27.89 32,32.16 v38.25,38.41
PC2  (via drill 0.35)
  Top 0.152: v39.93,18.44 35.05,13.56 27.43,13.56 26.98,14.02 27.43,14.48 27.43,15.09 U$1.PC2 | v43.89,30.33 43.43,30.33 43.28,30.18 42.67,30.18 42.37,30.48 42.37,44.2 44.2,46.02 JP1.7
  Bottom 0.152: v39.93,18.44 39.93,26.36 v43.89,30.33
PC3  (via drill 0.35)
  Top 0.152: v39.01,18.44 34.44,13.87 28.19,13.87 28.04,14.02 28.04,15.09 U$1.PC3 | v42.98,30.79 42.98,42.82 45.41,45.26 45.41,46.33 44.5,47.24 43.13,47.24 41.76,48.62 JP1.6
  Bottom 0.152: v39.01,18.44 39.01,26.82 v42.98,30.79
PC4
  Top 0.152: U$1.PC4 33.22,20.42 33.83,20.42 34.29,20.88 34.44,20.88 34.9,20.42 42.06,20.42 45.26,23.62 SPI_NRF2401.3
PC5
  Top 0.152: U$1.PC5 33.22,20.88 33.83,20.88 34.29,21.34 34.44,21.34 35.05,20.73 40.39,20.73 44.5,24.84 45.87,24.84 46.02,24.99 46.48,24.99 47.7,23.77 SPI_NRF2401.4
PC14  (via drill 0.35)
  Top 0.152: C28.2 21.03,34.9 24.23,34.9 32.7K.1 24.38,34.9 v25.45,33.83 | v23.01,13.56 23.01,15.09 U$1.PC14
  Bottom 0.152: v23.01,13.56 23.47,13.56 25.6,15.7 26.06,15.7 26.36,16 26.36,32.92 v25.45,33.83
PC15  (via drill 0.35)
  Top 0.152: 25.76,35.66 26.67,34.75 32.7K.2 | 25.76,35.66 23.47,37.95 20.88,37.95 C29.2 | v24.38,13.56 23.93,13.56 23.47,14.02 23.62,14.17 23.62,14.33 23.47,14.48 23.47,15.09 U$1.PC15 | 25.76,35.66 v25.6,35.51
  Bottom 0.152: v24.38,13.56 26.67,15.85 26.67,34.44 v25.6,35.51
PD13
  Top 0.152: U$1.PD13 26.98,30.79 26.98,31.24 26.82,31.39 26.82,31.55 37.34,42.06 37.34,44.35 39.01,46.02 JP1.3
PD14
  Top 0.152: U$1.PD14 26.52,30.63 26.52,29.57 26.67,29.41 31.85,29.41 37.64,35.2 37.64,42.67 40.54,45.57 40.54,47.09 39.17,48.46 JP1.4
PE9  (via drill 0.35)
  Top 0.152: v35.66,25.3 34.14,23.77 33.22,23.77 U$1.PE9 | v44.2,34.75 44.2,41.4 MOTOR.1
  Bottom 0.152: v35.66,25.3 35.66,26.21 v44.2,34.75
PE10  (via drill 0.35)
  Top 0.152: v36.42,26.06 35.51,26.06 33.83,24.38 33.22,24.38 U$1.PE10
  Bottom 0.152: MOTOR.7 43.34,32.92 36.48,26.06 v36.42,26.06
PE13  (via drill 0.35)
  Top 0.152: v32,26.06 32.31,25.76 32.46,25.76 32.61,25.91 33.07,25.91 U$1.PE13
  Bottom 0.152: MOTOR.2 47.24,41.9 47.24,40.5 46.66,39.92 45.86,39.92 v32,26.06
PE14  (via drill 0.35)
  Top 0.152: v34.44,26.98 33.83,26.36 33.22,26.36 U$1.PE14
  Bottom 0.152: v34.44,26.98 35.51,26.98 45.57,37.03 45.72,36.88 46.79,36.88 46.94,37.03 47.59,37.03 MOTOR.8
PH0
  Top 0.152: 21.18,3.96 21.64,3.96 23.62,1.98 24.69,1.98 R6.2 | 21.18,9.14 24.99,12.95 24.99,13.87 24.84,14.02 24.84,15.09 U$1.PH0 | 21.18,9.14 21.18,3.96 | 21.18,3.96 C26.2 | 21.18,9.14 Y2.2
PH1
  Top 0.152: R6.1 26.67,1.98 29.72,1.98 31.09,3.35 31.09,3.81 C27.2 31.09,3.96 31.09,8.84 30.79,9.14 Y2.1 30.63,9.3 25.45,14.48 25.45,15.09 U$1.PH1
VCAP1
  Top 0.152: U$1.VCAP1 33.22,28.5 34.14,28.5 35.05,27.58 35.51,27.58 C23.1
VCAP2
  Top 0.152: U$1.VCAP2 20.42,30.79 20.42,31.24 20.73,31.55 20.73,31.7 18.75,33.68 17.83,33.68 17.07,34.44 16.46,34.44 C24.1